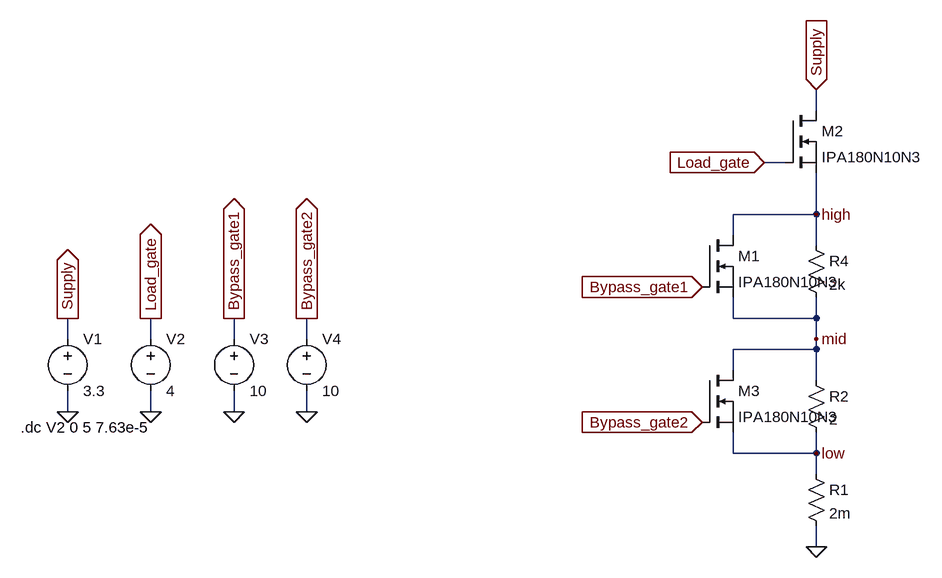
[diagram p0: schematic Bypass MOSFET.asc]
Bypass MOSFET.asc, the LTspice schematic file:
Version 4
SHEET 1 1572 680
WIRE 768 -208 768 -240
WIRE 720 -128 688 -128
WIRE 768 -48 768 -112
WIRE 768 -48 640 -48
WIRE 640 -16 640 -48
WIRE 768 0 768 -48
WIRE 640 112 640 80
WIRE 768 112 768 80
WIRE 768 112 640 112
WIRE -384 144 -384 112
WIRE -256 144 -256 112
WIRE -128 144 -128 112
WIRE -16 144 -16 112
WIRE 768 144 768 112
WIRE 768 160 768 144
WIRE 768 160 640 160
WIRE 640 192 640 160
WIRE 768 208 768 160
WIRE -384 256 -384 224
WIRE -256 256 -256 224
WIRE -128 256 -128 224
WIRE -16 256 -16 224
WIRE 640 320 640 288
WIRE 768 320 768 288
WIRE 768 320 640 320
WIRE 768 352 768 320
WIRE 768 464 768 432
FLAG -384 256 0
FLAG -256 256 0
FLAG -128 256 0
FLAG -384 112 Supply
IOPIN -384 112 Out
FLAG -256 112 Load_gate
IOPIN -256 112 Out
FLAG -128 112 Bypass_gate1
IOPIN -128 112 Out
FLAG 768 464 0
FLAG 768 -240 Supply
IOPIN 768 -240 In
FLAG 688 -128 Load_gate
IOPIN 688 -128 In
FLAG 768 320 low
FLAG 768 -48 high
FLAG 768 144 mid
FLAG -16 256 0
FLAG -16 112 Bypass_gate2
IOPIN -16 112 Out
FLAG 592 64 Bypass_gate1
IOPIN 592 64 In
FLAG 592 272 Bypass_gate2
IOPIN 592 272 In
SYMBOL voltage -384 128 R0
WINDOW 123 0 0 Left 2
WINDOW 39 0 0 Left 2
SYMATTR InstName V1
SYMATTR Value 3.3
SYMBOL voltage -256 128 R0
WINDOW 123 0 0 Left 2
WINDOW 39 0 0 Left 2
SYMATTR InstName V2
SYMATTR Value 4
SYMBOL voltage -128 128 R0
WINDOW 123 0 0 Left 2
WINDOW 39 0 0 Left 2
SYMATTR InstName V3
SYMATTR Value 10
SYMBOL res 752 336 R0
SYMATTR InstName R1
SYMATTR Value 2m
SYMBOL res 752 192 R0
SYMATTR InstName R2
SYMATTR Value 2
SYMBOL nmos 720 -208 R0
SYMATTR InstName M2
SYMATTR Value IPA180N10N3
SYMBOL res 752 -16 R0
SYMATTR InstName R4
SYMATTR Value 2k
SYMBOL nmos 592 -16 R0
SYMATTR InstName M1
SYMATTR Value IPA180N10N3
SYMBOL nmos 592 192 R0
SYMATTR InstName M3
SYMATTR Value IPA180N10N3
SYMBOL voltage -16 128 R0
WINDOW 123 0 0 Left 2
WINDOW 39 0 0 Left 2
SYMATTR InstName V4
SYMATTR Value 10
TEXT -456 280 Left 2 !.dc V2 0 5 7.63e-5

The netlist it stands for:
* Bypass MOSFET.asc
V1 Supply 0 3.3
V2 Load_gate 0 4
V3 Bypass_gate1 0 10
R1 low 0 2m
R2 mid low 2
M2 Supply Load_gate high high IPA180N10N3
R4 high mid 2k
M1 high Bypass_gate1 mid mid IPA180N10N3
M3 mid Bypass_gate2 low low IPA180N10N3
V4 Bypass_gate2 0 10
.model NMOS NMOS
.model PMOS PMOS
.lib standard.mos
.dc V2 0 5 7.63e-5
.backanno
.end